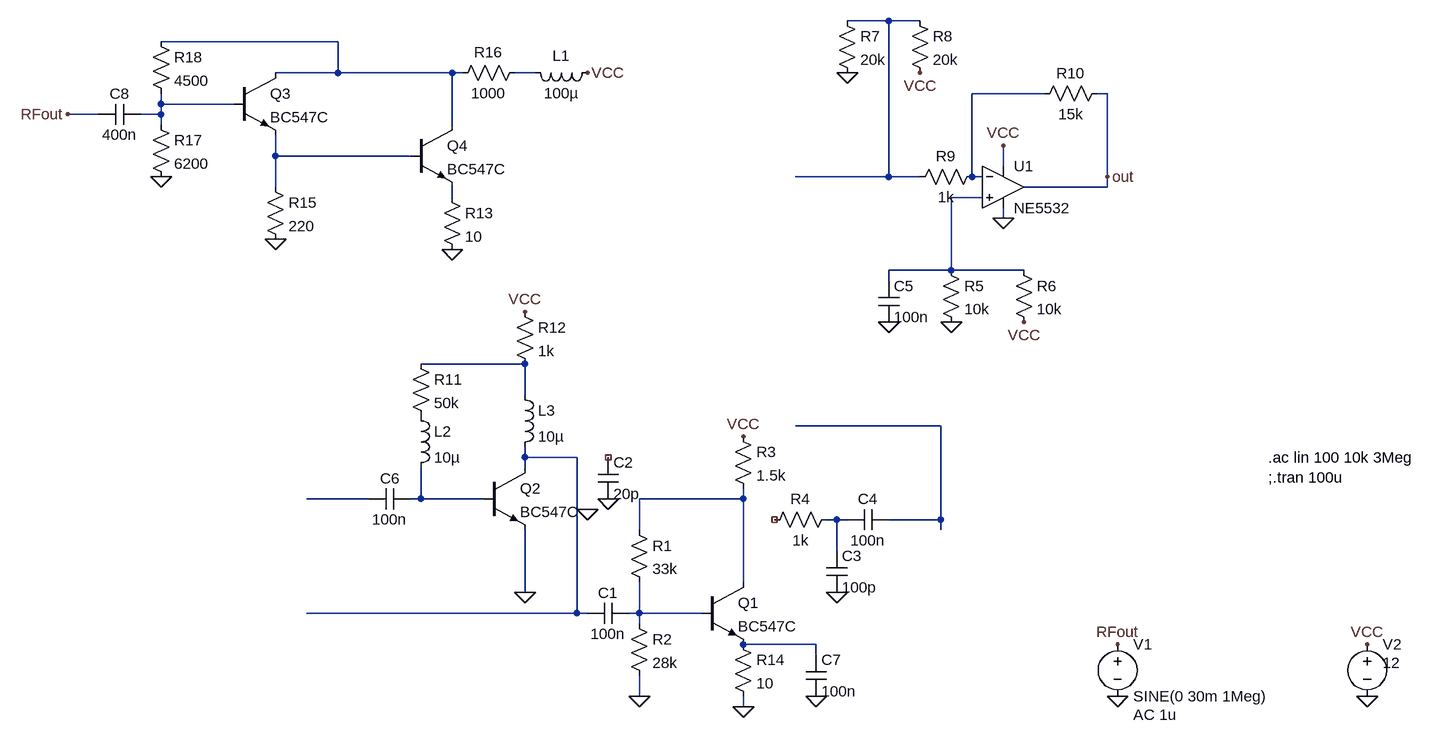
[diagram p0: schematic amplifier_characteristics.asc]
amplifier_characteristics.asc, the LTspice schematic file:
Version 4
SHEET 1 1900 1140
WIRE 848 32 784 32
WIRE 896 32 848 32
WIRE 0 64 -272 64
WIRE 0 112 0 64
WIRE 0 112 -96 112
WIRE 176 112 0 112
WIRE 192 112 176 112
WIRE 304 112 272 112
WIRE 1088 144 976 144
WIRE 1184 144 1168 144
WIRE -272 160 -272 144
WIRE -160 160 -272 160
WIRE -368 176 -416 176
WIRE -272 176 -272 160
WIRE -272 176 -304 176
WIRE -272 192 -272 176
WIRE 176 192 176 112
WIRE -96 240 -96 208
WIRE 112 240 -96 240
WIRE 1024 256 1024 224
WIRE 848 272 848 32
WIRE 848 272 704 272
WIRE 896 272 848 272
WIRE 976 272 976 144
WIRE 992 272 976 272
WIRE 1184 272 1184 144
WIRE -96 288 -96 240
WIRE 1184 288 1184 272
WIRE 1184 288 1056 288
WIRE 176 304 176 288
WIRE 992 304 944 304
WIRE 1024 336 1024 320
WIRE 944 416 944 304
WIRE 944 416 848 416
WIRE 1056 416 944 416
WIRE 848 432 848 416
WIRE 288 560 128 560
WIRE 288 608 288 560
WIRE 928 656 704 656
WIRE 288 704 288 688
WIRE 368 704 288 704
WIRE 288 720 288 704
WIRE 48 768 -48 768
WIRE 128 768 128 720
WIRE 128 768 112 768
WIRE 224 768 128 768
WIRE 624 768 624 752
WIRE 624 768 464 768
WIRE 768 800 752 800
WIRE 784 800 768 800
WIRE 928 800 928 656
WIRE 928 800 848 800
WIRE 464 816 464 768
WIRE 928 816 928 800
WIRE 768 848 768 800
WIRE 624 896 624 768
WIRE 288 912 288 816
WIRE 368 944 368 704
WIRE 368 944 -48 944
WIRE 384 944 368 944
WIRE 464 944 464 896
WIRE 464 944 448 944
WIRE 560 944 464 944
WIRE 464 960 464 944
WIRE 736 992 624 992
WIRE 736 1008 736 992
WIRE 464 1072 464 1040
WIRE 624 1088 624 1072
FLAG -416 176 RFout
FLAG 1200 1072 0
FLAG 624 1088 0
FLAG 464 1072 0
FLAG 624 672 VCC
FLAG 768 912 0
FLAG 1024 336 0
FLAG 1024 224 VCC
FLAG 944 496 0
FLAG 1056 496 VCC
FLAG 848 496 0
FLAG 784 112 0
FLAG 896 112 VCC
FLAG 288 912 0
FLAG 288 480 VCC
FLAG 1184 272 out
FLAG 1584 992 VCC
FLAG 1584 1072 0
FLAG 1200 992 RFout
FLAG 384 784 0
FLAG 416 768 0
FLAG 736 1072 0
FLAG -96 368 0
FLAG 176 384 0
FLAG 384 112 VCC
FLAG -272 272 0
SYMBOL voltage 1200 976 R0
WINDOW 123 24 124 Left 2
WINDOW 39 0 0 Left 0
SYMATTR Value2 AC 1u
SYMATTR InstName V1
SYMATTR Value SINE(0 30m 1Meg)
SYMBOL npn 560 896 R0
SYMATTR InstName Q1
SYMATTR Value BC547C
SYMBOL res 448 800 R0
SYMATTR InstName R1
SYMATTR Value 33k
SYMBOL res 448 944 R0
SYMATTR InstName R2
SYMATTR Value 28k
SYMBOL res 608 656 R0
SYMATTR InstName R3
SYMATTR Value 1.5k
SYMBOL cap 448 928 R90
WINDOW 0 0 32 VBottom 2
WINDOW 3 32 32 VTop 2
SYMATTR InstName C1
SYMATTR Value 100n
SYMBOL res 768 784 R90
WINDOW 0 0 56 VBottom 2
WINDOW 3 32 56 VTop 2
SYMATTR InstName R4
SYMATTR Value 1k
SYMBOL cap 752 848 R0
SYMATTR InstName C3
SYMATTR Value 100p
SYMBOL ZZZ\\OpAmp\\NE5532 1024 288 R0
SYMATTR InstName U1
SYMBOL cap 848 784 R90
WINDOW 0 0 32 VBottom 2
WINDOW 3 32 32 VTop 2
SYMATTR InstName C4
SYMATTR Value 100n
SYMBOL res 928 400 R0
SYMATTR InstName R5
SYMATTR Value 10k
SYMBOL res 1040 400 R0
SYMATTR InstName R6
SYMATTR Value 10k
SYMBOL cap 832 432 R0
SYMATTR InstName C5
SYMATTR Value 100n
SYMBOL res 768 16 R0
SYMATTR InstName R7
SYMATTR Value 20k
SYMBOL res 880 16 R0
SYMATTR InstName R8
SYMATTR Value 20k
SYMBOL res 992 256 R90
WINDOW 0 0 56 VBottom 2
WINDOW 3 32 56 VTop 2
SYMATTR InstName R9
SYMATTR Value 1k
SYMBOL res 1184 128 R90
WINDOW 0 0 56 VBottom 2
WINDOW 3 32 56 VTop 2
SYMATTR InstName R10
SYMATTR Value 15k
SYMBOL npn 224 720 R0
SYMATTR InstName Q2
SYMATTR Value BC547C
SYMBOL ind 112 624 R0
SYMATTR InstName L2
SYMATTR Value 10µ
SYMBOL ind 272 592 R0
SYMATTR InstName L3
SYMATTR Value 10µ
SYMBOL cap 112 752 R90
WINDOW 0 0 32 VBottom 2
WINDOW 3 32 32 VTop 2
SYMATTR InstName C6
SYMATTR Value 100n
SYMBOL res 112 544 R0
SYMATTR InstName R11
SYMATTR Value 50k
SYMBOL res 272 464 R0
SYMATTR InstName R12
SYMATTR Value 1k
SYMBOL voltage 1584 976 R0
WINDOW 123 0 0 Left 0
WINDOW 39 0 0 Left 0
WINDOW 3 24 44 Left 2
SYMATTR Value 12
SYMATTR InstName V2
SYMBOL res 608 976 R0
SYMATTR InstName R14
SYMATTR Value 10
SYMBOL cap 400 704 R0
SYMATTR InstName C2
SYMATTR Value 20p
SYMBOL cap 720 1008 R0
SYMATTR InstName C7
SYMATTR Value 100n
SYMBOL npn -160 112 R0
SYMATTR InstName Q3
SYMATTR Value BC547C
SYMBOL npn 112 192 R0
SYMATTR InstName Q4
SYMATTR Value BC547C
SYMBOL res 160 288 R0
SYMATTR InstName R13
SYMATTR Value 10
SYMBOL res -112 272 R0
SYMATTR InstName R15
SYMATTR Value 220
SYMBOL res 288 96 R90
WINDOW 0 0 56 VBottom 2
WINDOW 3 32 56 VTop 2
SYMATTR InstName R16
SYMATTR Value 1000
SYMBOL ind 400 96 R90
WINDOW 0 5 56 VBottom 2
WINDOW 3 32 56 VTop 2
SYMATTR InstName L1
SYMATTR Value 100µ
SYMBOL res -288 176 R0
SYMATTR InstName R17
SYMATTR Value 6200
SYMBOL res -288 48 R0
SYMATTR InstName R18
SYMATTR Value 4500
SYMBOL cap -304 160 R90
WINDOW 0 0 32 VBottom 2
WINDOW 3 32 32 VTop 2
SYMATTR InstName C8
SYMATTR Value 400n
TEXT 1432 704 Left 2 !.ac lin 100 10k 3Meg\n;.tran 100u

The netlist it stands for:
* amplifier_characteristics.asc
V1 RFout 0 SINE(0 30m 1Meg) AC 1u
Q1 N014 N016 N017 0 BC547C
R1 N014 N016 33k
R2 N016 0 28k
R3 VCC N014 1.5k
C1 N016 N011 100n
R4 N015 NC_01 1k
C3 N015 0 100p
XU1 N008 N004 VCC 0 out NE5532  ; pins In+ In- V+ V- OUT
C4 N010 N015 100n
R5 N008 0 10k
R6 N008 VCC 10k
C5 N008 0 100n
R7 N001 0 20k
R8 N001 VCC 20k
R9 N004 N001 1k
R10 out N004 15k
Q2 N011 N013 0 0 BC547C
L2 P001 N013 10µ
L3 N009 N011 10µ
C6 N013 N012 100n
R11 N009 P001 50k
R12 VCC N009 1k
V2 VCC 0 12
R14 N017 0 10
C2 NC_02 0 20p
C7 N017 0 100n
Q3 N002 N005 N006 0 BC547C
Q4 N002 N006 N007 0 BC547C
R13 N007 0 10
R15 N006 0 220
R16 N003 N002 1000
L1 VCC N003 100µ
R17 N005 0 6200
R18 N002 N005 4500
C8 N005 RFout 400n
.model NPN NPN
.model PNP PNP
.lib standard.bjt
.ac lin 100 10k 3Meg
;.tran 100u
.backanno
.end